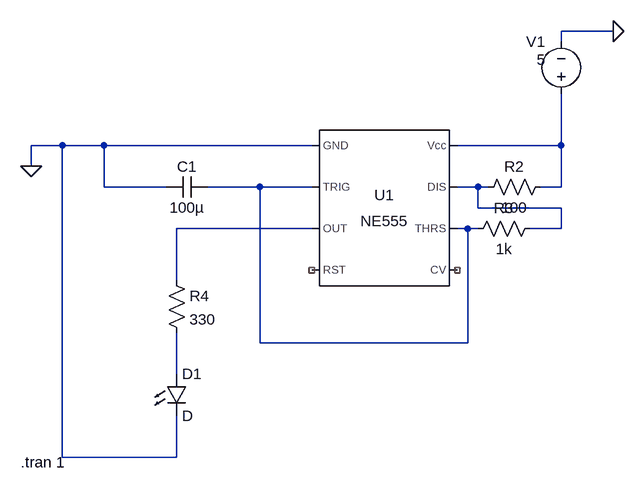
[diagram p0: schematic astable(square_wave)_555.asc]
astable(square_wave)_555.asc, the LTspice schematic file:
Version 4
SHEET 1 880 680
WIRE 560 -96 480 -96
WIRE 480 -80 480 -96
WIRE -288 80 -336 80
WIRE -224 80 -288 80
WIRE 96 80 -224 80
WIRE 480 80 480 0
WIRE 480 80 320 80
WIRE -336 112 -336 80
WIRE -224 144 -224 80
WIRE -128 144 -224 144
WIRE 16 144 -64 144
WIRE 96 144 16 144
WIRE 352 144 320 144
WIRE 368 144 352 144
WIRE 480 144 480 80
WIRE 480 144 448 144
WIRE 352 176 352 144
WIRE 480 176 352 176
WIRE 96 208 -112 208
WIRE 336 208 320 208
WIRE 352 208 336 208
WIRE 480 208 480 176
WIRE 480 208 432 208
WIRE -112 288 -112 208
WIRE 16 384 16 144
WIRE 336 384 336 208
WIRE 336 384 16 384
WIRE -112 432 -112 368
WIRE -288 560 -288 80
WIRE -112 560 -112 496
WIRE -112 560 -288 560
FLAG -336 112 0
FLAG 560 -96 0
SYMBOL Misc\\NE555 208 176 R0
SYMATTR InstName U1
SYMBOL voltage 480 16 R180
WINDOW 0 24 96 Left 2
WINDOW 3 24 68 Left 2
WINDOW 123 0 0 Left 0
WINDOW 39 0 0 Left 0
SYMATTR InstName V1
SYMATTR Value 5
SYMBOL res 464 128 R90
WINDOW 0 0 56 VBottom 2
WINDOW 3 32 56 VTop 2
SYMATTR InstName R2
SYMATTR Value 100
SYMBOL res 448 192 R90
WINDOW 0 0 56 VBottom 2
WINDOW 3 32 56 VTop 2
SYMATTR InstName R3
SYMATTR Value 1k
SYMBOL res -128 272 R0
SYMATTR InstName R4
SYMATTR Value 330
SYMBOL LED -128 432 R0
SYMATTR InstName D1
SYMBOL cap -64 128 R90
WINDOW 0 0 32 VBottom 2
WINDOW 3 32 32 VTop 2
SYMATTR InstName C1
SYMATTR Value 100µ
TEXT -352 568 Left 2 !.tran 1

The netlist it stands for:
* astable(square_wave)_555.asc
XU1 0 N002 N004 NC_01 NC_02 N002 N003 N001 NE555  ; pins GND TRIG OUT RST CV THRS DIS Vcc
V1 N001 0 5
R2 N001 N003 100
R3 N003 N002 1k
R4 N004 N005 330
D1 N005 0 D
C1 N002 0 100µ
.model D D
.lib standard.dio
.tran 1
.lib NE555.sub
.backanno
.end